# EAGLE design board_schem_2 (EAGLE 9.6.2)
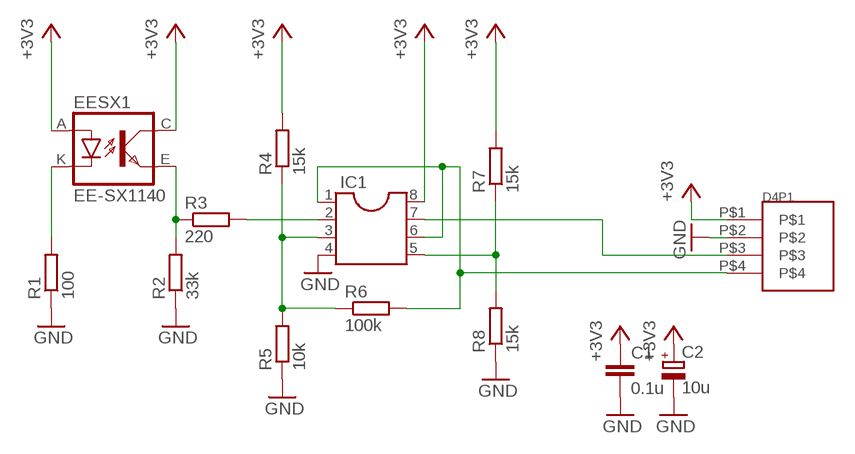
[diagram p0: schematic, sheet 1]

## Parts
C1  0.1u  C-EU050-024X044  [C050-024X044]
C2  10u  CPOL-EUE2.5-5  [E2,5-5]
D4P1  DF1E-4P  [DF1E-4P]
EESX1  EE-SX1140  [EE-SX1140]
IC1  DIL8  [DIL08]
R1  100  R-EU_0207/10  [0207/10]
R2  33k  R-EU_0207/10  [0207/10]
R3  220  R-EU_0207/10  [0207/10]
R4  15k  R-EU_0207/10  [0207/10]
R5  10k  R-EU_0207/10  [0207/10]
R6  100k  R-EU_0207/10  [0207/10]
R7  15k  R-EU_0207/10  [0207/10]
R8  15k  R-EU_0207/10  [0207/10]

## Nets
+3V3 [3v3]: C1.1 C2.+ D4P1.P$1 EESX1.A EESX1.C(COL) IC1.8 R4.2 R7.2
GND [gnd]: C1.2 C2.- D4P1.P$2 IC1.4 R1.1 R2.1 R5.1 R8.1
N$1: EESX1.K(C) R1.2
N$2: EESX1.E(EMIT) R2.2 R3.1
N$3: IC1.2 R3.2
N$4: D4P1.P$4 IC1.1 IC1.6 R6.2
N$5: IC1.5 R7.1 R8.2
N$6: IC1.3 R4.1 R5.2 R6.1
N$7: D4P1.P$3 IC1.7

## Library data of the parts
C1 = rcl:C-EU: CAPACITOR, European symbol; SPICEPREFIX: C
C2 = rcl:CPOL-EU: POLARIZED CAPACITOR, European symbol; SPICEPREFIX: C
D4P1 = lib_test:DF1E-4P
EESX1 = lib_test:EE-SX1140
IC1 = ic-package:DIL8: Dual In Line / Socket
R1-R8 = rcl:R-EU_: RESISTOR, European symbol; SPICEPREFIX: R

## Net classes
0 default: width 0.508 mm, clearance 0.508 mm
1 gnd: width 1.27 mm, clearance 0.508 mm
2 3v3: width 1.016 mm, clearance 0.508 mm

## Board
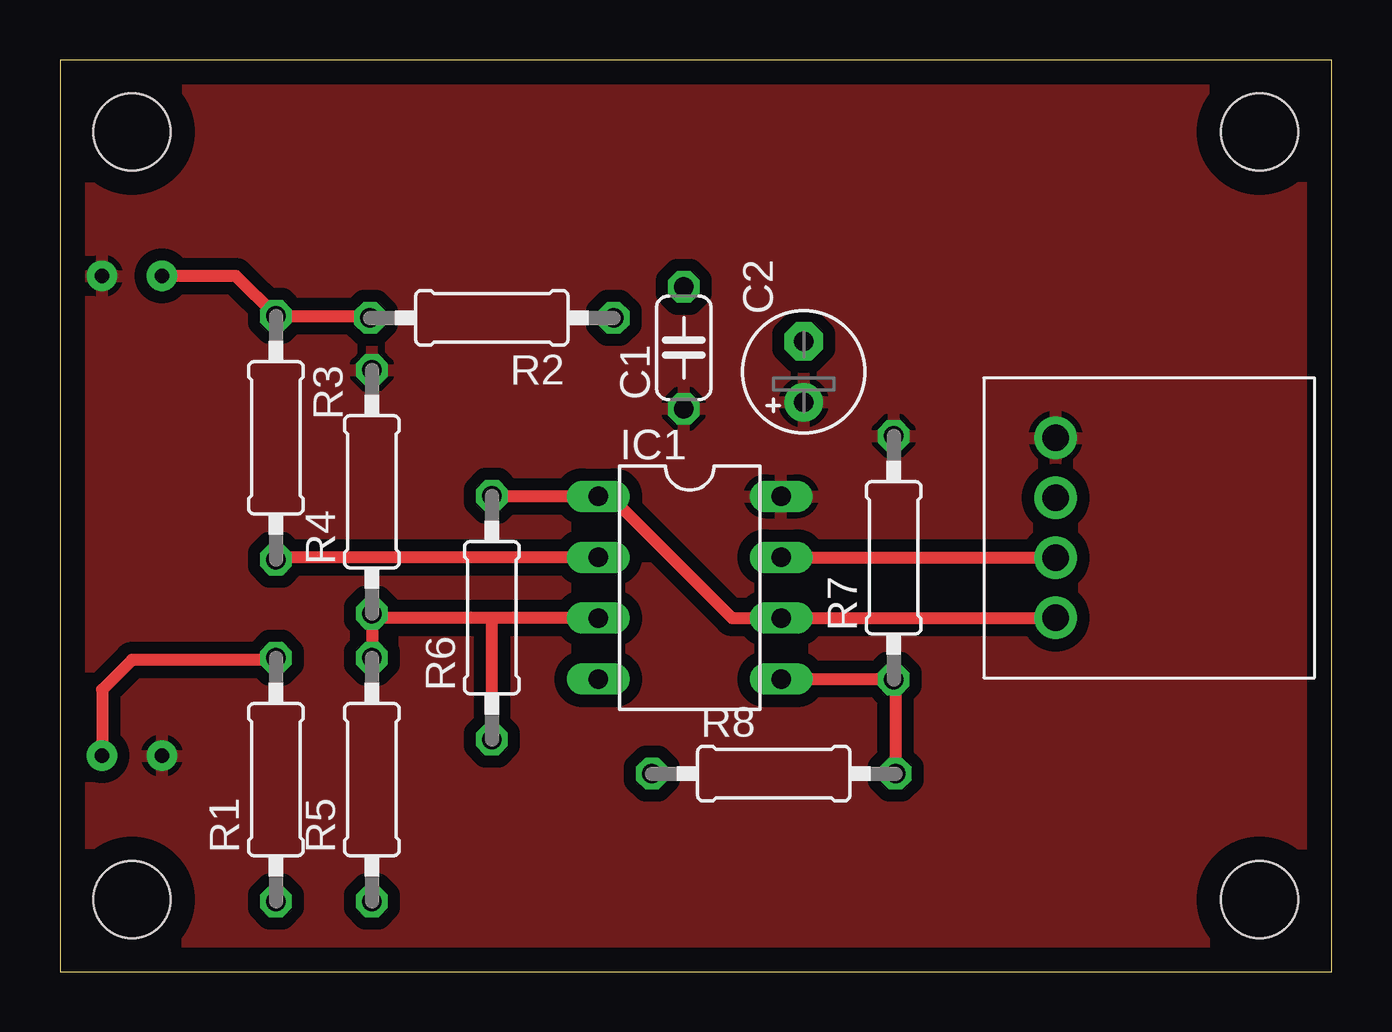
[diagram p1: board, top side]
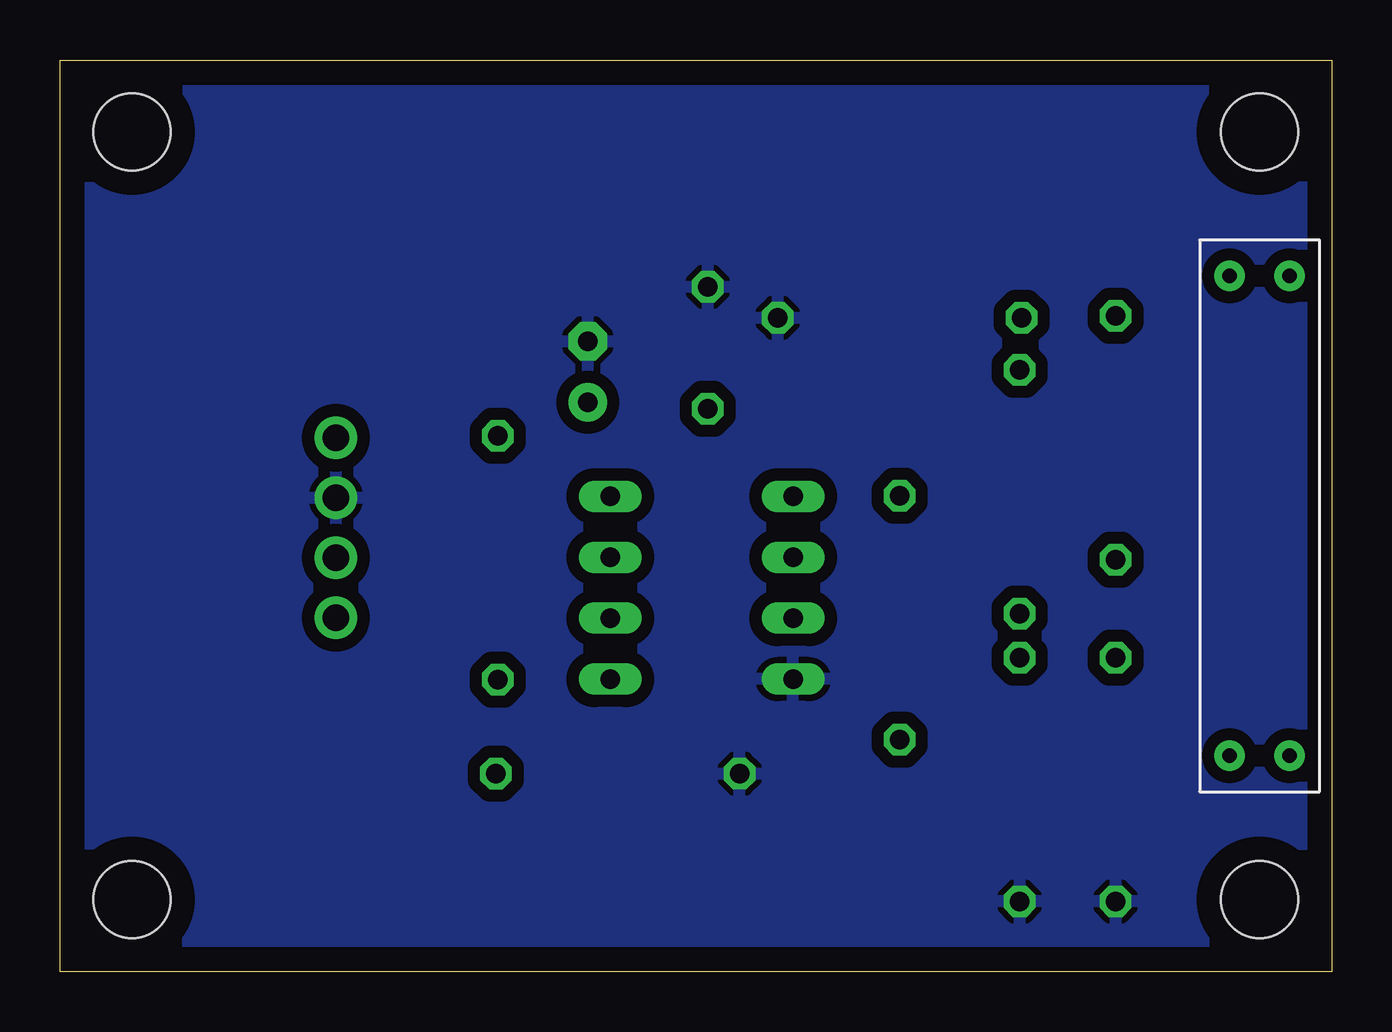
[diagram p2: board, bottom side, seen from below]

Size 53 x 38 mm. Coordinates in mm from the lower left corner, seen from the top.
Outline: 0,0 53,0 53,38 0,38 0,0
Copper layers (1*16): Top 0.035mm / dielectric 1.5mm / Bottom 0.035mm
Design rules "default": minimum track width 6mil, minimum drill 0.35mm, track to track 6mil, track to pad 6mil, pad to pad 6mil, via to via 6mil, smd to smd 6mil, copper to edge 40mil, drill to drill 6mil, minimum pad ring 10mil, minimum via ring 8mil, stop-mask expansion 4mil, vias tented up to drill 0mil, thermal gap 10mil
Holes 3.2 mm at 3,3 3,35 50,35 50,3

### Footprints (pad centres in the part's own frame; a part is rotated, then mirrored left to right if it is on the bottom)
C050-024X044 = drill 0.813 octagon: 1 -2.54,0; 2 2.54,0
E2,5-5 = drill 0.813 pad 1.6: + -1.27,0 | drill 0.813 pad 1.6 octagon: - 1.27,0
DF1E-4P = drill 1.1 pad 1.778: P$1 0,3.75; P$2 0,1.25; P$3 0,-1.25; P$4 0,-3.75
EE-SX1140 = drill 0.6 pad 1.27: A 1.25,10; C -1.25,-10; E 1.25,-10; K -1.25,10
DIL08 = drill 0.813 long: 1 -3.81,-3.81; 2 -1.27,-3.81; 3 1.27,-3.81; 4 3.81,-3.81; 5 3.81,3.81; 6 1.27,3.81; 7 -1.27,3.81; 8 -3.81,3.81
0207/10 = drill 0.813 octagon: 1 -5.08,0; 2 5.08,0

### Placement (x,y rotation side)
C1  26,26 90 top
C2  31,25 90 top
D4P1  41.5,18.5 0 top
EESX1  3,19 180 bottom
IC1  26.25,16 270 top
R1  9,8 90 top
R2  18,27.25 180 top
R3  9,22.25 270 top
R4  13,20 90 top
R5  13,8 90 top
R6  18,14.75 90 top
R7  34.75,17.25 90 top
R8  29.75,8.25 0 top

### Tracks (layer width: path | path; a pad name or v marks a point on that pad's centre or on a via)
+3V3
  pour Top: 0,38 0,0 53,0 53,38
GND
  pour Bottom: 0,38 0,0 53,0 53,38
N$1
  Top 0.508: R1.2 8.92,13 3,13 1.75,11.75 EESX1.K
N$2
  Top 0.508: EESX1.E 7.33,29 R3.1 12.84,27.33 R2.2
N$3
  Top 0.508: IC1.2 9.1,17.27 R3.2
N$4
  Top 0.508: R6.2 18.02,19.81 IC1.1 22.94,19.81 28.02,14.73 IC1.6 41.48,14.73 D4P1.P$4
N$5
  Top 0.508: IC1.5 34.73,12.19 R7.1 34.83,12.09 R8.2
N$6
  Top 0.508: IC1.3 18,14.73 | 18,14.73 13.19,14.73 R4.1 R5.2 | R6.1 18,14.73
N$7
  Top 0.508: IC1.7 41.48,17.27 D4P1.P$3